# Altium schematic sheet LeakSensor.SchDoc
size A
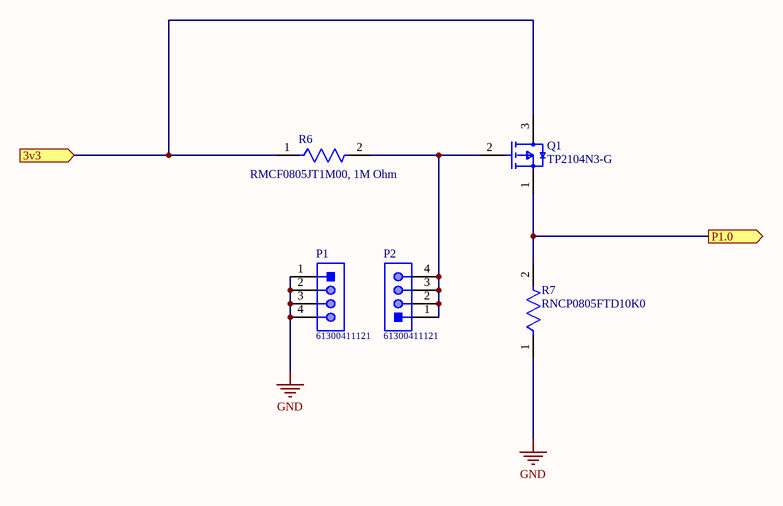
[diagram p0: LeakSensor.SchDoc]

## Parts
P1  61300411121  [61300411121]
P2  61300411121  [61300411121]
Q1  TP2104N3-G  [FP-TP2104N3-G-MFG]
R6  RMCF0805JT1M00, 1M Ohm  [FP-RMCF0805-IPC_C]
R7  RNCP0805FTD10K0  [FP-RNCP0805-IPC_C]

## Ports
3v3 (in), P1.0 (out)

## Nets
GND: P1.1 P1.2 P1.3 P1.4 R7.1
3v3: Q1.3(Drain) R6.1 ; port 3v3
P1.0: Q1.1(Source) R7.2 ; port P1.0
NetP2_1: P2.1 P2.2 P2.3 P2.4 Q1.2(Gate) R6.2

## Library data of the parts
P1 P2 = CMP-1502-01064-1: THT Vertical Pin Header WR-PHD, Pitch 2.54 mm, Single Row, 4 pins; Manufacturer: Wurth Elektronik; Withstanding Voltage: 500VAC; Rated Current: 3A; Working Voltage: 250VAC; Pin Number: 4; Gender: Male; Contact Resistance: 20mOhm; Pitch: 2.54mm; Manufacturer URL: http://www.we-online.de; Operating Temperature: -40to105degC; Packaging: Bag; Mounting Technology: THT; Package Reference: 61300411121; Datasheet URL: https://katalog.we-online.de/em/datasheet/6130xx11121.pdf; Publisher: WurthElektronik; Part Number: 61300411121; Row Number: Single; Orientation: Vertical
Q1 = CMP-06369-000017-1: MOSFET P-CH 40V 175MA TO92-3; Turn-On Delay Time: 4ns; Drain to Source Resistance: 6R; Element Configuration: Single; Gate to Source Voltage (Vgs): 20V; Drain to Source Breakdown Voltage: -40V; Max Power Dissipation: 740mW; Number of Channels: 1; Input Capacitance: 60pF; Turn-Off Delay Time: 5ns; Polarity: P-CHANNEL; Max Operating Temperature: 150°C; Lead Free: Lead Free; Series: -; Mount: Through Hole; Number of Pins: 3; Min Operating Temperature: -55°C; Case/Package: TO-92-3; RoHS Compliant: Yes; Length: 5.21mm; Continuous Drain Current (ID): 175mA; Height: 5.33mm; Package Quantity: 1000; Drain to Source Voltage (Vdss): 40V; Rise Time: 4ns; Packaging: Bulk; Power Dissipation: 740mW; Fall Time: 4ns; Weight: 0.016oz; Width: 4.19mm; Rds On Max: 6R
R6 = CMP-26527-000066-1: 1MΩ ±5% 0.125W 0805 Thick Film Chip Resistor AEC-Q200 compliant; Temperature Coefficient: 200ppm/°C; Max Power Dissipation: 125mW; Resistance: 1MR; Construction: Rectangular; Case Code (Metric): 2012; Radiation Hardening: No; Contact Plating: Tin; Military Standard: Not; Features: Automotive AEC-Q200; Resistor Type: Thick Film; Series: RMCF; Length: 2mm; Min Operating Temperature: -55°C; Case Code (Imperial): 0805; Height: 0.026inch; Mount: Surface Mount; Max Operating Temperature: 155°C; Depth: 1.25mm; Width: 0.049inch; Packaging: Tape and Reel; Number of Terminations: 2; Case/Package: 0805; Tolerance: 5%; Lead Free: Lead Free; RoHS Compliant: Yes
R7 = CMP-26527-007436-1: 10kΩ ±1% 0.25W 0805 High Power Anti-Sulfur Thin Film Chip Resistor; Resistance: 10kR; Max Power Dissipation: 250mW; Temperature Coefficient: 100ppm/°C; Number of Terminations: 2; Length: 0.079inch; Case Code (Metric): 2012; Mount: Surface Mount; Resistor Type: Thin Film; Packaging: Tape and Reel; Tolerance: 1%; RoHS Compliant: Yes; Case Code (Imperial): 0805; Min Operating Temperature: -55°C; Max Operating Temperature: 155°C; Features: Moisture Resistant; Series: RNCP; Case/Package: 0805; Width: 0.049inch; Lead Free: Lead Free; Height: 0.024inch